# EAGLE design ping_imu_nano_v2 (EAGLE 9.6.1)
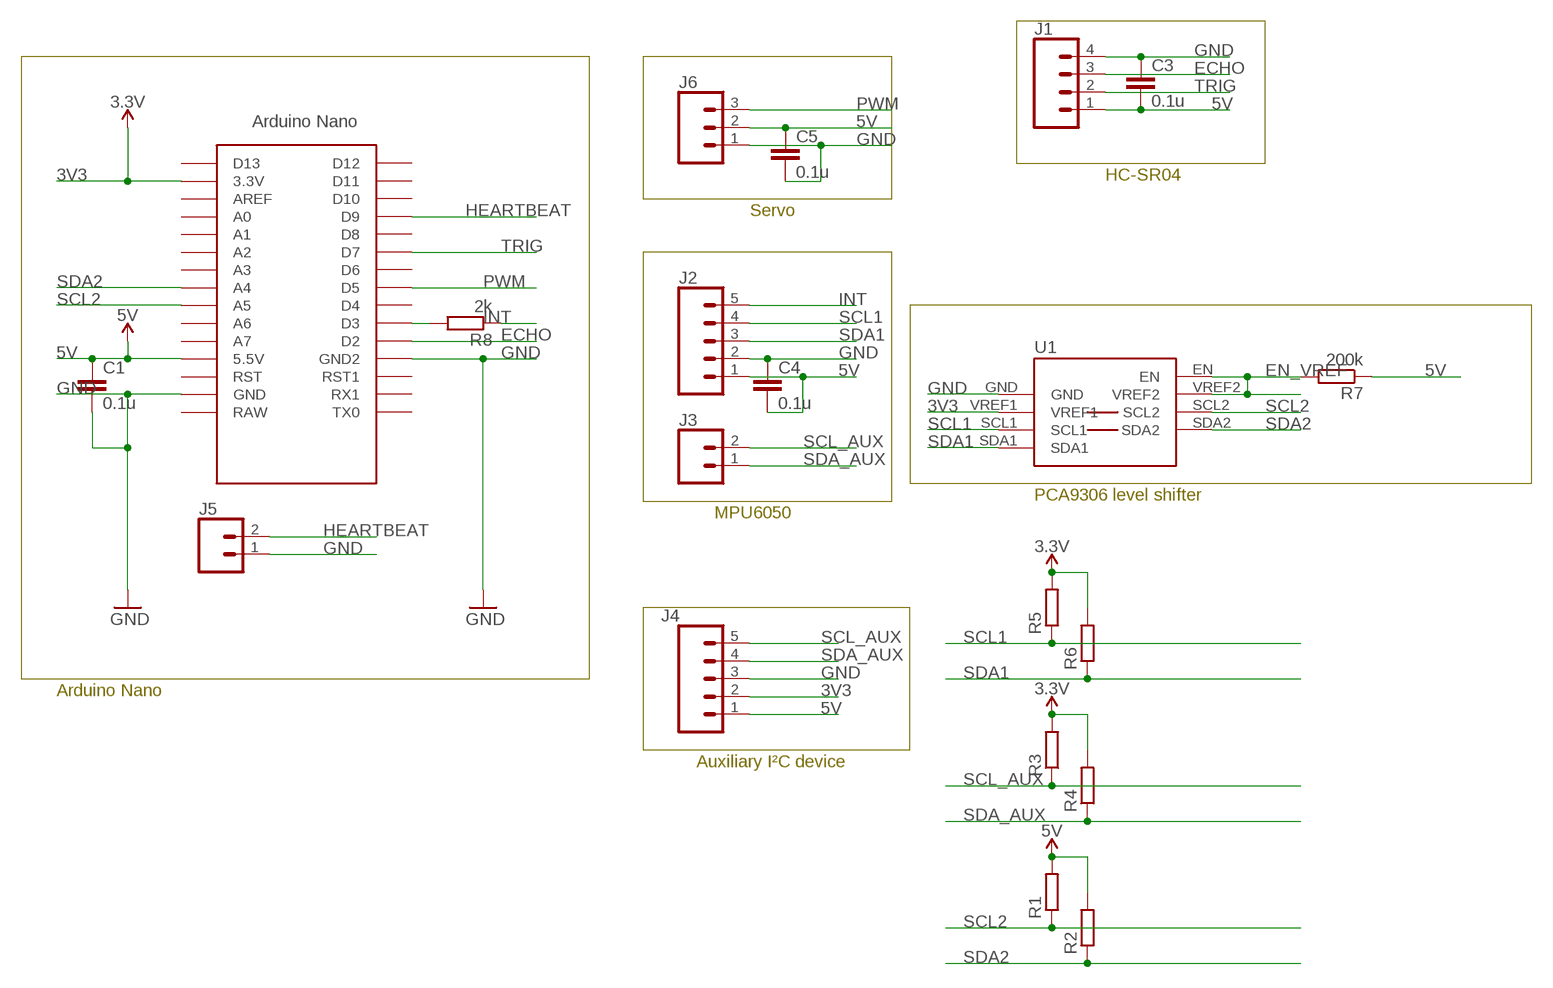
[diagram p0: schematic, sheet 1]

## Parts
C1  0.1u  C-EUC1206  [C1206]
C3  0.1u  C-EUC1206  [C1206]
C4  0.1u  C-EUC1206  [C1206]
C5  0.1u  C-EUC1206  [C1206]
J1  CONN_04LONGPADS  [1X04_LONGPADS]
J2  CONN_05PTH_LONGPADS  [1X05_LONGPADS]
J3  CONN_02PTH3  [1X02_LONGPADS]
J4  CONN_05PTH_LONGPADS  [1X05_LONGPADS]
J5  CONN_02PTH3  [1X02_LONGPADS]
J6  CONN_03LONGPADS  [1X03_LONGPADS]
R1  R-EU_M1206  [M1206]
R2  R-EU_M1206  [M1206]
R3  R-EU_M1206  [M1206]
R4  R-EU_M1206  [M1206]
R5  R-EU_M1206  [M1206]
R6  R-EU_M1206  [M1206]
R7  200k  R-EU_M1206  [M1206]
R8  2k  R-EU_M1206  [M1206]
U1  PCA9306SO8  [SO8]
U$1  NANO_BARE  [NANO_BARE]

## Nets
3V3 [pwr]: J4.2 R3.2 R4.2 R5.2 R6.2 U1.VREF1 U$1.3.3V ; supply symbol labelled 3.3V
5V [pwr]: C1.1 C3.2 C4.2 C5.1 J1.1 J2.1 J4.1 J6.2 R1.2 R2.2 R7.1 U$1.5V(5.5V)
ECHO: J1.3 U$1.D2
EN_VREF [pwr]: R7.2 U1.EN U1.VREF2
GND [pwr]: C1.2 C3.1 C4.1 C5.2 J1.4 J2.2 J4.3 J5.1 J6.1 U1.GND U$1.GND U$1.GND1(GND2)
HEARTBEAT: J5.2 U$1.D9
INT: J2.5 R8.1
N$1: R8.2 U$1.D3
PWM: J6.3 U$1.D5
SCL1: J2.4 R5.1 U1.SCL1
SCL2: R1.1 U1.SCL2 U$1.A5
SCL_AUX: J3.2 J4.5 R3.1
SDA1: J2.3 R6.1 U1.SDA1
SDA2: R2.1 U1.SDA2 U$1.A4
SDA_AUX: J3.1 J4.4 R4.1
TRIG: J1.2 U$1.D7
Unconnected: U$1.A0 U$1.A1 U$1.A2 U$1.A3 U$1.A6 U$1.A7 U$1.AREF U$1.D4 U$1.D6 U$1.D8 U$1.D10 U$1.D11 U$1.D12 U$1.D13 U$1.RAW U$1.RST U$1.RST1 U$1.RX1 U$1.TX0

## Notes on the sheet
- HC-SR04
- Servo
- PCA9306 level shifter
- MPU6050
- Arduino Nano
- Auxiliary I²C device

## Library data of the parts
C1 C3-C5 = rcl:C-EU: CAPACITOR, European symbol
J1 = SparkFun-Connectors:CONN_04: Multi connection point. Often used as Generic Header-pin footprint for 0.1 inch spaced/style header connections On any of the 0.1 inch spaced packages, you can populate with these: Break Away Headers - Straight <https://www.sparkfun.com/products/116> (PRT-00116) Break Away Male Headers - Right Angle <https://www.sparkfun.com/products/553> (PRT-00553) Female Headers <https://www.sparkfun.com/products/115> (PRT-00115) Break Away Headers - Machine Pin <https://www.sparkfun.com/products/117> (PRT-00117) Break Away Female Headers - Swiss Machine Pin <https://www.sparkfun.com/products/743> (PRT-00743) For SCREWTERMINALS and SPRING TERMINALS visit here: Screw Terimnals on SparkFun.com <https://www.sparkfun.com/search/results?term=Screw+Terminals> (5mm/3.5mm/2.54mm spacing) This device is also useful as a general connection point to wire up your design to another part of your project. Our various solder wires solder well into these plated through hole pads. Hook-Up Wire - Assortment (Stranded, 22 AWG) <https://www.sparkfun.com/products/11375> (PRT-11375) Hook-Up Wire - Assortment (Solid Core, 22 AWG) <https://www.sparkfun.com/products/11367> (PRT-11367) View the entire wire category on our website here <https://www.sparkfun.com/categories/141> Special notes: Molex polarized connector foot print use with SKU : PRT-08231 with associated crimp pins and housings. 1MM SMD Version SKU: PRT-10208; PROD_ID: CONN-09696
J2 J4 = SparkFun-Connectors:CONN_05: Multi connection point. Often used as Generic Header-pin footprint for 0.1 inch spaced/style header connections On any of the 0.1 inch spaced packages, you can populate with these: Break Away Headers - Straight <https://www.sparkfun.com/products/116> (PRT-00116) Break Away Male Headers - Right Angle <https://www.sparkfun.com/products/553> (PRT-00553) Female Headers <https://www.sparkfun.com/products/115> (PRT-00115) Break Away Headers - Machine Pin <https://www.sparkfun.com/products/117> (PRT-00117) Break Away Female Headers - Swiss Machine Pin <https://www.sparkfun.com/products/743> (PRT-00743) For SCREWTERMINALS and SPRING TERMINALS visit here: Screw Terimnals on SparkFun.com <https://www.sparkfun.com/search/results?term=Screw+Terminals> (5mm/3.5mm/2.54mm spacing) This device is also useful as a general connection point to wire up your design to another part of your project. Our various solder wires solder well into these plated through hole pads. Hook-Up Wire - Assortment (Stranded, 22 AWG) <https://www.sparkfun.com/products/11375> (PRT-11375) Hook-Up Wire - Assortment (Solid Core, 22 AWG) <https://www.sparkfun.com/products/11367> (PRT-11367) View the entire wire category on our website here <https://www.sparkfun.com/categories/141> Special notes: Molex polarized connector foot print use with SKU : PRT-08231 with associated crimp pins and housings. 1MM SMD Version SKU: PRT-10208
J3 J5 = SparkFun-Connectors:CONN_02: Multi connection point. Often used as Generic Header-pin footprint for 0.1 inch spaced/style header connections On any of the 0.1 inch spaced packages, you can populate with these: Break Away Headers - Straight <https://www.sparkfun.com/products/116> (PRT-00116) Break Away Male Headers - Right Angle <https://www.sparkfun.com/products/553> (PRT-00553) Female Headers <https://www.sparkfun.com/products/115> (PRT-00115) Break Away Headers - Machine Pin <https://www.sparkfun.com/products/117> (PRT-00117) Break Away Female Headers - Swiss Machine Pin <https://www.sparkfun.com/products/743> (PRT-00743) For SCREWTERMINALS and SPRING TERMINALS visit here: Screw Terimnals on SparkFun.com <https://www.sparkfun.com/search/results?term=Screw+Terminals> (5mm/3.5mm/2.54mm spacing) This device is also useful as a general connection point to wire up your design to another part of your project. Our various solder wires solder well into these plated through hole pads. Hook-Up Wire - Assortment (Stranded, 22 AWG) <https://www.sparkfun.com/products/11375> (PRT-11375) Hook-Up Wire - Assortment (Solid Core, 22 AWG) <https://www.sparkfun.com/products/11367> (PRT-11367) View the entire wire category on our website here <https://www.sparkfun.com/categories/141> Special notes: Molex polarized connector foot print use with: PRT-08233 with associated crimp pins and housings. 2.54_SCREWTERM for use with PRT-10571. 3.5mm Screw Terminal footprints for PRT-08084 5mm Screw Terminal footprints for use with PRT-08432
J6 = SparkFun-Connectors:CONN_03: Multi connection point. Often used as Generic Header-pin footprint for 0.1 inch spaced/style header connections On any of the 0.1 inch spaced packages, you can populate with these: Break Away Headers - Straight <https://www.sparkfun.com/products/116> (PRT-00116) Break Away Male Headers - Right Angle <https://www.sparkfun.com/products/553> (PRT-00553) Female Headers <https://www.sparkfun.com/products/115> (PRT-00115) Break Away Headers - Machine Pin <https://www.sparkfun.com/products/117> (PRT-00117) Break Away Female Headers - Swiss Machine Pin <https://www.sparkfun.com/products/743> (PRT-00743) Stackable Header - 3 Pin (Female, 0.1") <https://www.sparkfun.com/products/13875> (PRT-13875) For SCREWTERMINALS and SPRING TERMINALS visit here: Screw Terimnals on SparkFun.com <https://www.sparkfun.com/search/results?term=Screw+Terminals> (5mm/3.5mm/2.54mm spacing) This device is also useful as a general connection point to wire up your design to another part of your project. Our various solder wires solder well into these plated through hole pads. Hook-Up Wire - Assortment (Stranded, 22 AWG) <https://www.sparkfun.com/products/11375> (PRT-11375) Hook-Up Wire - Assortment (Solid Core, 22 AWG) <https://www.sparkfun.com/products/11367> (PRT-11367) View the entire wire category on our website here <https://www.sparkfun.com/categories/141> Special notes: Molex polarized connector foot print use with SKU : PRT-08232 with associated crimp pins and housings.
R1-R8 = rcl:R-EU_: RESISTOR, European symbol
U1 = PCA9306DC1:PCA9306: Bidirectional I2C level shifter. NOT compatible with all available part number pinout schemes- DOUBLE CHECK!!!
U$1 = Arduino-clone:NANO_BARE: Arduino Nano

## Net classes
0 default: width 0.5 mm, clearance 0.4 mm
1 pwr: width 0.7 mm, clearance 0.4 mm

## Board
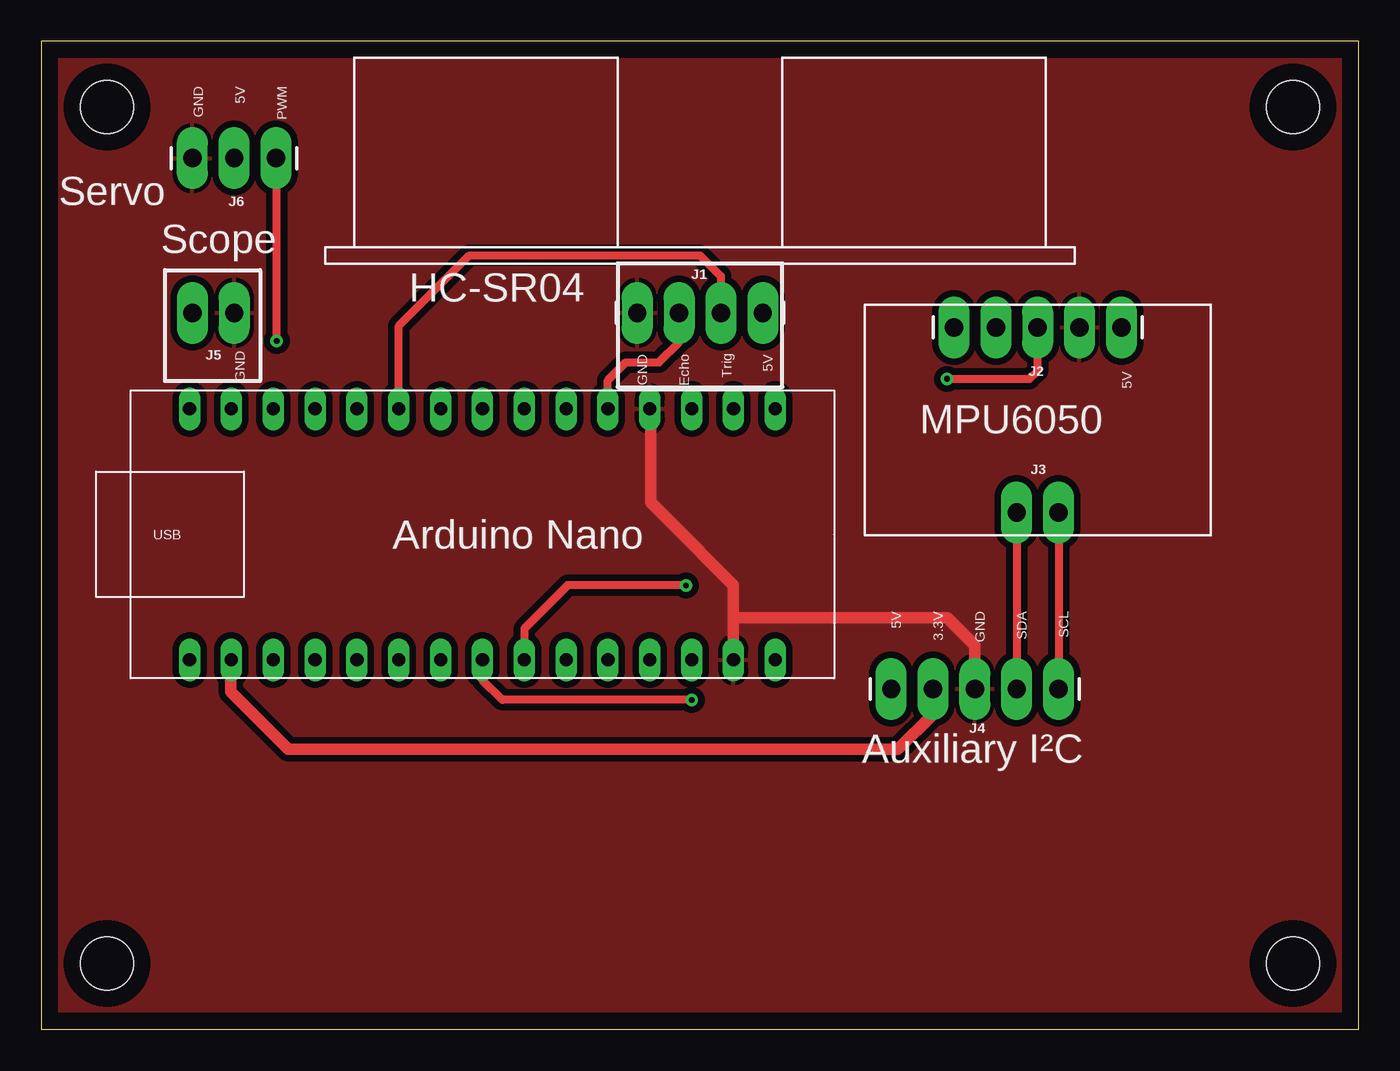
[diagram p1: board, top side]
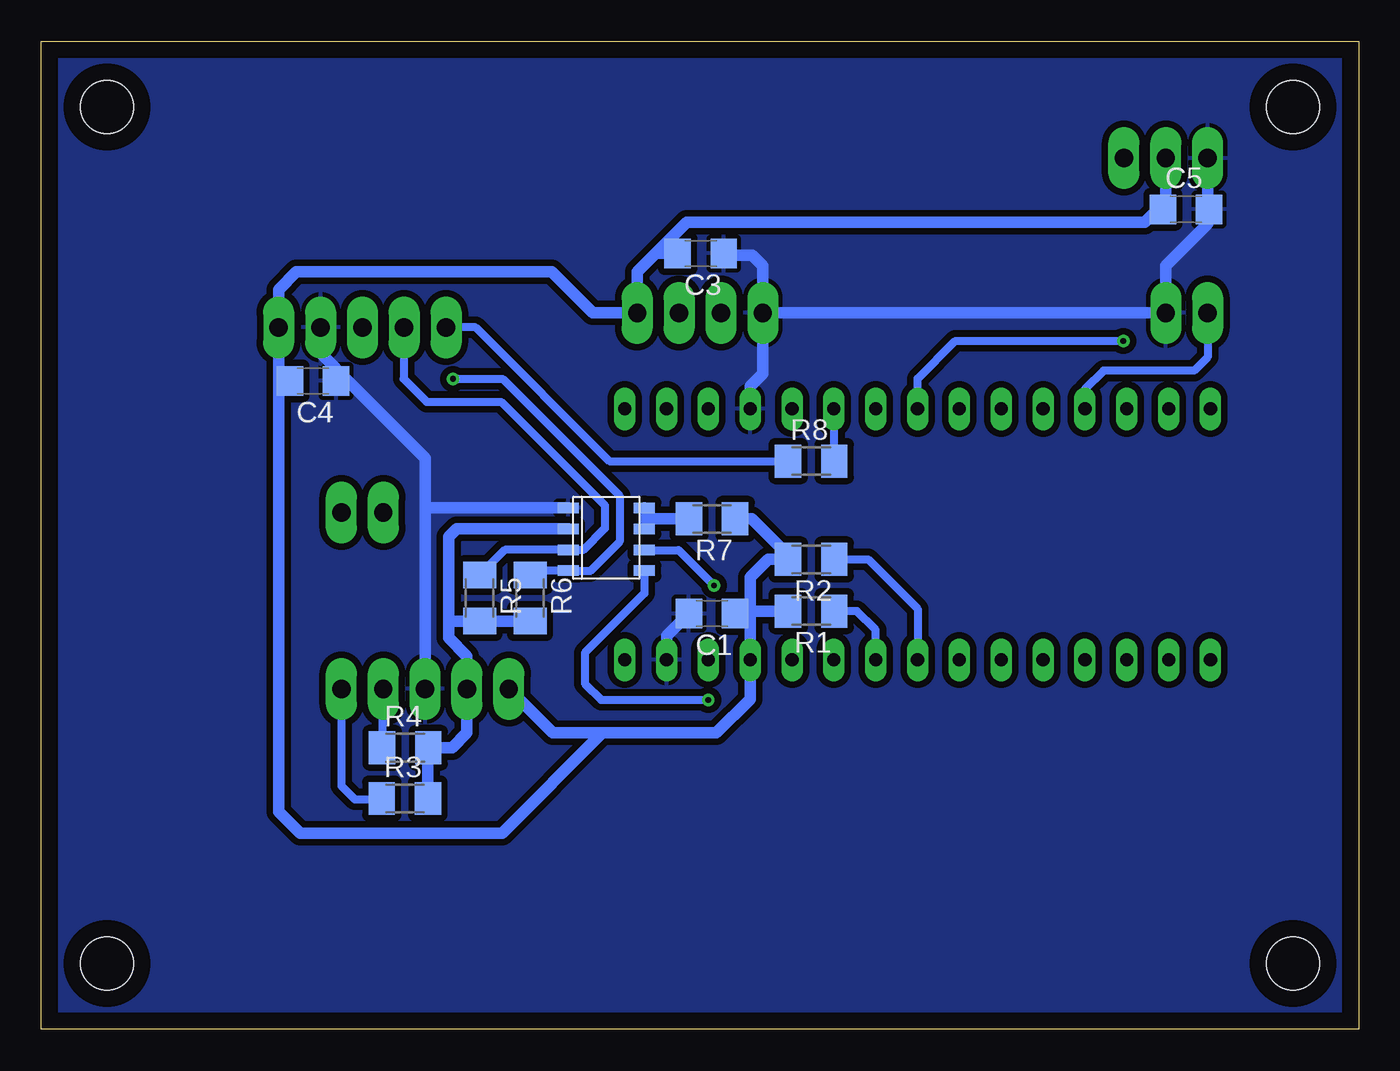
[diagram p2: board, bottom side, seen from below]

Size 80 x 60 mm. Coordinates in mm from the lower left corner, seen from the top.
Outline: 0,0 80,0 80,60 0,60 0,0
Copper layers (1*16): Top 0.035mm / dielectric 1.5mm / Bottom 0.035mm
Design rules "default": minimum track width 6mil, minimum drill 0.35mm, track to track 6mil, track to pad 6mil, pad to pad 6mil, via to via 6mil, smd to smd 6mil, copper to edge 40mil, drill to drill 6mil, minimum pad ring 10mil, minimum via ring 8mil, stop-mask expansion 4mil, vias tented up to drill 0mil, thermal gap 10mil
Holes 3.2 mm at 76,56 76,4 4,4 4,56

### Footprints (pad centres in the part's own frame; a part is rotated, then mirrored left to right if it is on the bottom)
C1206 = smd 1.6 x 1.8: 1 -1.4,0; 2 1.4,0
1X04_LONGPADS = drill 1.118 pad 1.88 long: 1 0,0; 2 2.54,0; 3 5.08,0; 4 7.62,0
1X05_LONGPADS = drill 1.118 pad 1.88 long: 1 0,0; 2 2.54,0; 3 5.08,0; 4 7.62,0; 5 10.16,0
1X02_LONGPADS = drill 1.118 pad 1.88 long: 1 0,0; 2 2.54,0
1X03_LONGPADS = drill 1.118 pad 1.88 long: 1 0,0; 2 2.54,0; 3 5.08,0
M1206 = smd 1.6 x 2: 1 -1.4,0; 2 1.4,0
SO8 = smd 1.27 x 0.635: EN 2.31,1.81; GND -2.31,1.81; SCL1 -2.31,-0.73; SCL2 2.31,-0.73; SDA1 -2.31,-2; SDA2 2.31,-2; VREF1 -2.31,0.54; VREF2 2.31,0.54
NANO_BARE = drill 0.8 long: 3.3V -7.62,15.24; 5V -7.62,-10.16; A0 -7.62,10.16; A1 -7.62,7.62; A2 -7.62,5.08; A3 -7.62,2.54; A4 -7.62,0; A5 -7.62,-2.54; A6 -7.62,-5.08; A7 -7.62,-7.62; AREF -7.62,12.7; D2 7.62,-7.62; D3 7.62,-5.08; D4 7.62,-2.54; D5 7.62,0; D6 7.62,2.54; D7 7.62,5.08; D8 7.62,7.62; D9 7.62,10.16; D10 7.62,12.7; D11 7.62,15.24; D12 7.62,17.78; D13 -7.62,17.78; GND -7.62,-15.24; GND1 7.62,-10.16; RAW -7.62,-17.78; RST -7.62,-12.7; RST1 7.62,-12.7; RX1 7.62,-15.24; TX0 7.62,-17.78

### Placement (x,y rotation side)
C1  39.27,25.25 180 bottom
C3  39.96,47.11 180 bottom
C4  63.5,39.37 180 bottom
C5  10.49,49.79 0 bottom
J1  43.81,43.5 180 top
J2  65.58,42.62 180 top
J3  59.23,31.38 0 top
J4  51.61,20.67 0 top
J5  11.72,43.5 180 top
J6  9.18,52.9 0 top
R1  33.25,25.4 180 bottom
R2  33.25,28.54 180 bottom
R3  57.92,14.02 0 bottom
R4  57.9,17.1 0 bottom
R5  53.38,26.19 270 bottom
R6  50.31,26.19 270 bottom
R7  39.27,31 180 bottom
R8  33.25,34.5 0 bottom
U1  45.69,29.85 0 bottom
U$1  26.79,30.06 90 top

### Tracks (layer width: path | path; a pad name or v marks a point on that pad's centre or on a via)
3V3
  Top 0.7: U$1.3.3V 11.5,22.39 11.5,20.5 15,17 52,17 54.15,19.15 J4.2
  Bottom 0.7: 55.25,24.79 55.25,29.9 54.76,30.39 U1.VREF1 | 55.25,24.79 55.25,23.77 54.15,22.67 J4.2 54.15,18 55.05,17.1 R4.2 56.52,17.08 R3.2 | 55.25,24.79 R5.2 R6.2
5V
  Bottom 0.7: 45.92,18 39,18 36.95,20.05 U$1.5V 36.95,25.4 | 45.92,18 52,11.92 64.27,11.92 65.58,13.23 65.58,39.37 | 65.58,39.37 J2.1 65.58,44.92 64.5,46 49,46 46.5,43.5 J1.1 43.81,45.99 42.69,47.11 | 36.95,25.4 36.95,27.45 35.86,28.54 R2.2 34.65,28.78 36.87,31 R7.1 | J6.2 11.72,50.28 12.21,49.79 | 12.21,49.79 13,49 40.8,49 42.69,47.11 | C1.1 37.1,25.25 36.95,25.4 | C3.2 42.69,47.11 | C4.2 65.58,39.37 | C5.1 12.21,49.79 | J4.1 48.94,18 45.92,18 | R1.2 36.95,25.4
ECHO
  Top 0.5: U$1.D2 34.41,39.41 35.5,40.5 37.5,40.5 38.73,41.73 J1.3
EN_VREF
  Bottom 0.7: U1.EN 43.38,31 | 43.38,31 U1.VREF2 | R7.2 43.38,31
GND
  Top 0.7: U$1.GND1 37,37.63 37,32 38,31 42.03,26.97 42.03,25 | 42.03,25 U$1.GND | 42.03,25 55,25 56.69,23.31 J4.3
  Bottom 0.7: J1.4 J5.1 11.72,46.38 9.18,48.92 9.18,49.7 | U$1.GND1 36.95,39.05 36.2,39.8 J1.4 | J2.2 63.04,41.04 61.16,39.16 | 56.69,31.65 56.69,34.69 61.16,39.16 | 56.69,31.65 J4.3 | 9.18,49.7 J6.1 | C1.2 42.03,23.89 U$1.GND | C3.1 38.44,46.99 36.83,46.99 36.19,46.35 J1.4 | C4.1 61.9,39.16 61.16,39.16 | C5.2 9.18,49.7 | U1.GND 56.68,31.66 56.69,31.65
  pour Top: 0,60 0,0.1 80,0.1 80,60
  pour Bottom: 0,60 0,0 80,0 80,60
HEARTBEAT
  Bottom 0.5: J5.2 9.18,40.82 10,40 15.5,40 16.63,38.87 U$1.D9
INT
  Bottom 0.5: J2.5 53.62,42.62 45.5,34.5 R8.1
N$1
  Bottom 0.5: R8.2 31.85,37.66 U$1.D3
PWM  (via drill 0.35)
  Top 0.5: v14.3,41.8 14.3,52.86 J6.3
  Bottom 0.5: U$1.D5 26.79,39.51 24.5,41.8 v14.3,41.8
SCL1
  Bottom 0.5: J2.4 58,42.58 58,39.5 56.6,38.1 52.07,38.1 45.78,31.81 45.78,30.42 47.1,29.1 47.98,29.1 U1.SCL1 51.85,29.12 R5.1
SCL2  (via drill 0.35)
  Top 0.5: v39.15,26.95 39.13,26.97 31.97,26.97 29.33,24.33 U$1.A5
  Bottom 0.5: R1.1 30.48,25.4 29.33,24.25 U$1.A5 | v39.15,26.95 41.3,29.1 43.36,29.1 U1.SCL2
SCL_AUX
  Top 0.5: J3.2 J4.5
  Bottom 0.5: J4.5 61.77,14.78 60.96,13.97 59.37,13.97 R3.1
SDA1  (via drill 0.35)
  Top 0.5: v55,39.5 60,39.5 60.5,40 J2.3
  Bottom 0.5: v55,39.5 51.98,39.5 44.88,32.4 44.88,29.62 46.67,27.83 47.98,27.83 U1.SDA1 50.05,27.85 R6.1
SDA2  (via drill 0.35)
  Top 0.5: v39.5,20 28,20 26.79,21.21 U$1.A4
  Bottom 0.5: v39.5,20 46,20 46.99,20.99 46.99,22.86 43.38,26.47 U1.SDA2 | R2.1 29.79,28.54 26.79,25.54 U$1.A4
SDA_AUX
  Top 0.5: J3.1 J4.4
  Bottom 0.5: J4.4 59.3,20.6 R4.1
TRIG
  Top 0.5: U$1.D7 21.71,42.71 26,47 40,47 41.27,45.73 J1.2

### Text on the board
tPlace: GND | 5V | PWM | Servo | Scope | HC-SR04 | GND | GND | Echo | Trig | 5V | 5V | MPU6050 | USB | Arduino Nano | 5V | 3.3V | GND | SDA | SCL | Auxiliary I²C